# Altium project Virtex.PrjPcb (part 2 of 3)

## Sheet BoardB-FPGA.SchDoc
size A; SheetNumber: 3; SheetTotal: 9
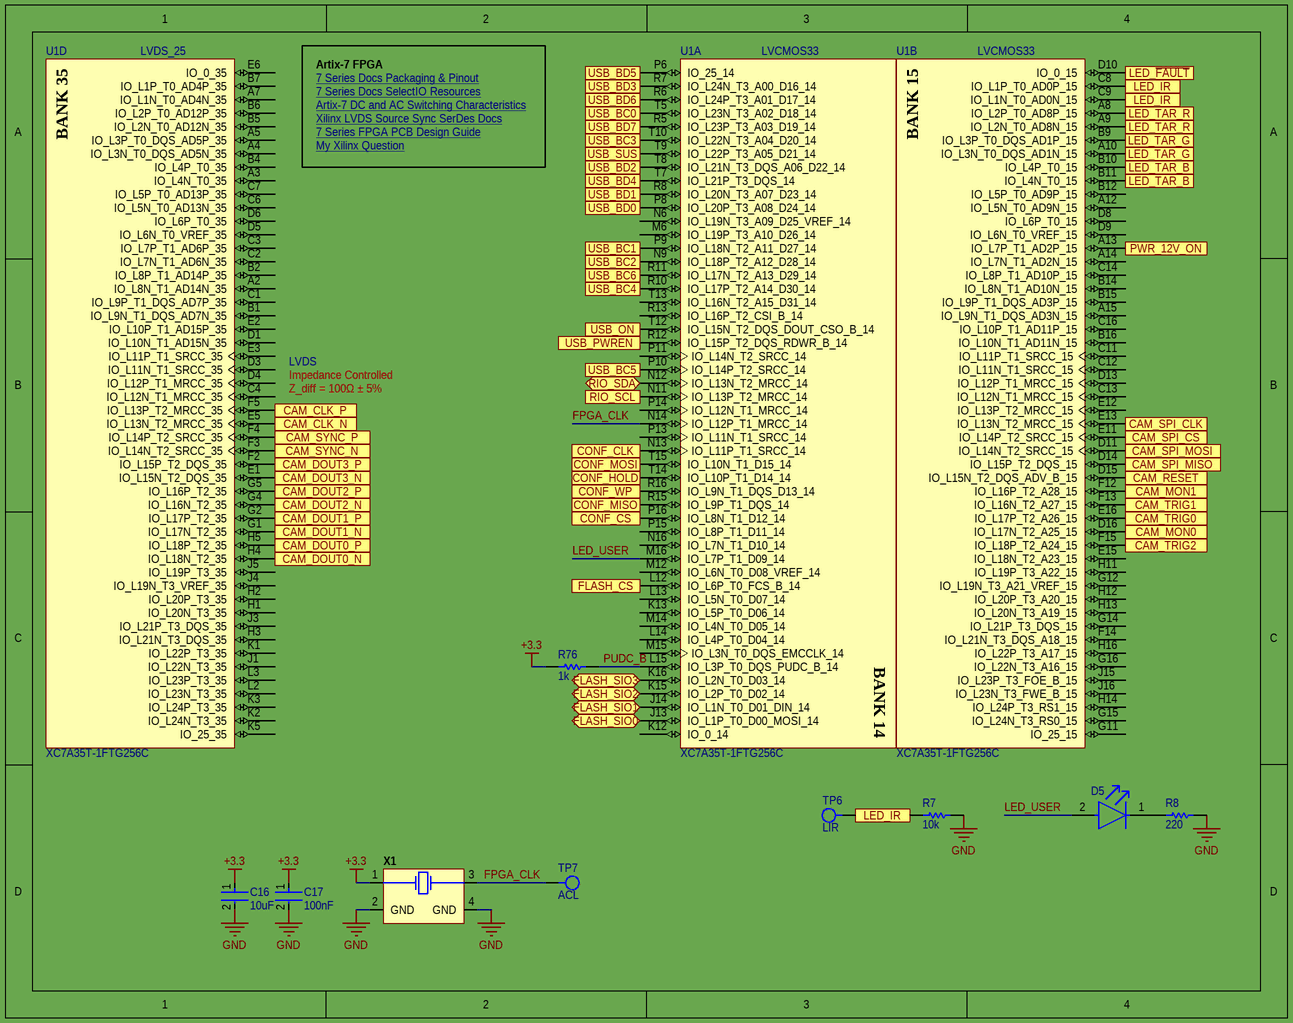
[diagram p2: BoardB-FPGA.SchDoc]

### Parts
C16  10uF  [FP-GRM188-0_1-e0_2_0_55-IPC_A]
C17  100nF  [FP-CGA3E-0_3-0_1-IPC_A]
D5  SML-D12U1WT86  [FP-SML-D12-MFG]  (value not drawn)
R7  10k  [RESC1609X55X30LL15T15]
R8  220  [RESC1005X40X25LL05T05]
R76  1k  [RESC0603X26X15ML03T05]
TP6  LIR  [TestPoint1mm]
TP7  ACL  [TestPoint1mm]
U1  XC7A35T-1FTG256C  [FTG256]  (parts A,B,D of 8)
X1  ASDMB-100.000MHZ-XY-T  [ASTMHTA-100.000MHZ-AJ-E-T]  (value not drawn)

### Ports
CAM_CLK_N (in), CAM_CLK_P (in), CAM_DOUT0_N (in), CAM_DOUT0_P (in), CAM_DOUT1_N (in), CAM_DOUT1_P (in), CAM_DOUT2_N (in), CAM_DOUT2_P (in), CAM_DOUT3_N (in), CAM_DOUT3_P (in), CAM_MON0 (in), CAM_MON1 (in), CAM_RESET (out), CAM_SPI_CLK (out), CAM_SPI_CS (out), CAM_SPI_MISO (in), CAM_SPI_MOSI (out), CAM_SYNC_N (in), CAM_SYNC_P (in), CAM_TRIG0 (out), CAM_TRIG1 (out), CAM_TRIG2 (out), CONF_CLK (out), CONF_CS (out), CONF_HOLD (out), CONF_MISO (in), CONF_MOSI (out), CONF_WP (out), FLASH_CS (out), FLASH_SIO0 (bidir), FLASH_SIO1 (bidir), FLASH_SIO2 (bidir), FLASH_SIO3 (bidir), LED_IR (out), LED_TAR_B (out), LED_TAR_G (out), LED_TAR_R (out), LED_~{FAULT} (in), PWR_12V_ON (in), RIO_SCL (in), RIO_SDA (bidir), USB_BC0, USB_BC1, USB_BC2, USB_BC3, USB_BC4, USB_BC5, USB_BC6, USB_BD0, USB_BD1, USB_BD2, USB_BD3, USB_BD4, USB_BD5, USB_BD6, USB_BD7, USB_ON (out), USB_PWREN (in), USB_SUS (in)

### Nets
+3.3: C16.1 C17.1 R76.2 X1.1
GND: C16.2 C17.2 R7.2 R8.2 X1.2(GND) X1.4(GND)
CAM_CLK_N: U1.E5(IO_L13N_T2_MRCC_35) ; port CAM_CLK_N
CAM_CLK_P: U1.F5(IO_L13P_T2_MRCC_35) ; port CAM_CLK_P
CAM_DOUT0_N: U1.H4(IO_L18N_T2_35) ; port CAM_DOUT0_N
CAM_DOUT0_P: U1.H5(IO_L18P_T2_35) ; port CAM_DOUT0_P
CAM_DOUT1_N: U1.G1(IO_L17N_T2_35) ; port CAM_DOUT1_N
CAM_DOUT1_P: U1.G2(IO_L17P_T2_35) ; port CAM_DOUT1_P
CAM_DOUT2_N: U1.G4(IO_L16N_T2_35) ; port CAM_DOUT2_N
CAM_DOUT2_P: U1.G5(IO_L16P_T2_35) ; port CAM_DOUT2_P
CAM_DOUT3_N: U1.E1(IO_L15N_T2_DQS_35) ; port CAM_DOUT3_N
CAM_DOUT3_P: U1.F2(IO_L15P_T2_DQS_35) ; port CAM_DOUT3_P
CAM_MON0: U1.D16(IO_L17N_T2_A25_15) ; port CAM_MON0
CAM_MON1: U1.F12(IO_L16P_T2_A28_15) ; port CAM_MON1
CAM_RESET: U1.D15(IO_L15N_T2_DQS_ADV_B_15) ; port CAM_RESET
CAM_SPI_CLK: U1.E13(IO_L13N_T2_MRCC_15) ; port CAM_SPI_CLK
CAM_SPI_CS: U1.E11(IO_L14P_T2_SRCC_15) ; port CAM_SPI_CS
CAM_SPI_MISO: U1.D14(IO_L15P_T2_DQS_15) ; port CAM_SPI_MISO
CAM_SPI_MOSI: U1.D11(IO_L14N_T2_SRCC_15) ; port CAM_SPI_MOSI
CAM_SYNC_N: U1.F3(IO_L14N_T2_SRCC_35) ; port CAM_SYNC_N
CAM_SYNC_P: U1.F4(IO_L14P_T2_SRCC_35) ; port CAM_SYNC_P
CAM_TRIG0: U1.E16(IO_L17P_T2_A26_15) ; port CAM_TRIG0
CAM_TRIG1: U1.F13(IO_L16N_T2_A27_15) ; port CAM_TRIG1
CAM_TRIG2: U1.F15(IO_L18P_T2_A24_15) ; port CAM_TRIG2
CONF_CLK: U1.N13(IO_L11P_T1_SRCC_14) ; port CONF_CLK
CONF_CS: U1.P16(IO_L8N_T1_D12_14) ; port CONF_CS
CONF_HOLD: U1.T14(IO_L10P_T1_D14_14) ; port CONF_HOLD
CONF_MISO: U1.R15(IO_L9P_T1_DQS_14) ; port CONF_MISO
CONF_MOSI: U1.T15(IO_L10N_T1_D15_14) ; port CONF_MOSI
CONF_WP: U1.R16(IO_L9N_T1_DQS_D13_14) ; port CONF_WP
FLASH_CS: U1.L12(IO_L6P_T0_FCS_B_14) ; port FLASH_CS
FLASH_SIO0: U1.J13(IO_L1P_T0_D00_MOSI_14) ; port FLASH_SIO0
FLASH_SIO1: U1.J14(IO_L1N_T0_D01_DIN_14) ; port FLASH_SIO1
FLASH_SIO2: U1.K15(IO_L2P_T0_D02_14) ; port FLASH_SIO2
FLASH_SIO3: U1.K16(IO_L2N_T0_D03_14) ; port FLASH_SIO3
FPGA_CLK: TP7.1 U1.N14(IO_L12P_T1_MRCC_14) X1.3
LED_USER: D5.2(A) U1.M16(IO_L7P_T1_D09_14)
PUDC_B: R76.1 U1.L15(IO_L3P_T0_DQS_PUDC_B_14)
USB_BC0: U1.T5(IO_L23N_T3_A02_D18_14) ; port USB_BC0
USB_BC1: U1.P9(IO_L18N_T2_A11_D27_14) ; port USB_BC1
USB_BC2: U1.N9(IO_L18P_T2_A12_D28_14) ; port USB_BC2
USB_BC3: U1.T10(IO_L22N_T3_A04_D20_14) ; port USB_BC3
USB_BC4: U1.R10(IO_L17P_T2_A14_D30_14) ; port USB_BC4
USB_BC5: U1.P10(IO_L14P_T2_SRCC_14) ; port USB_BC5
USB_BC6: U1.R11(IO_L17N_T2_A13_D29_14) ; port USB_BC6
USB_BD0: U1.P8(IO_L20P_T3_A08_D24_14) ; port USB_BD0
USB_BD1: U1.R8(IO_L20N_T3_A07_D23_14) ; port USB_BD1
USB_BD2: U1.T8(IO_L21N_T3_DQS_A06_D22_14) ; port USB_BD2
USB_BD3: U1.R7(IO_L24N_T3_A00_D16_14) ; port USB_BD3
USB_BD4: U1.T7(IO_L21P_T3_DQS_14) ; port USB_BD4
USB_BD5: U1.P6(IO_25_14) ; port USB_BD5
USB_BD6: U1.R6(IO_L24P_T3_A01_D17_14) ; port USB_BD6
USB_BD7: U1.R5(IO_L23P_T3_A03_D19_14) ; port USB_BD7
USB_PWREN: U1.R12(IO_L15P_T2_DQS_RDWR_B_14) ; port USB_PWREN
USB_PWRSAV: U1.T12(IO_L15N_T2_DQS_DOUT_CSO_B_14) ; port USB_ON
USB_SUS: U1.T9(IO_L22P_T3_A05_D21_14) ; port USB_SUS
NetD5_1: D5.1(C) R8.1
NetR1_1: U1.N12(IO_L13N_T2_MRCC_14) ; port RIO_SDA
NetR3_1: U1.N11(IO_L13P_T2_MRCC_14) ; port RIO_SCL
NetR5_1: U1.A13(IO_L7P_T1_AD2P_15) ; port PWR_12V_ON
NetR7_1: R7.1 TP6.1 U1.C8(IO_L1P_T0_AD0P_15) U1.C9(IO_L1N_T0_AD0N_15) ; port LED_IR
NetR51_2: U1.D10(IO_0_15) ; port LED_~{FAULT}
NetR63_2: U1.A8(IO_L2P_T0_AD8P_15) U1.A9(IO_L2N_T0_AD8N_15) ; port LED_TAR_R
NetR64_2: U1.A10(IO_L3N_T0_DQS_AD1N_15) U1.B9(IO_L3P_T0_DQS_AD1P_15) ; port LED_TAR_G
NetR65_2: U1.B10(IO_L4P_T0_15) U1.B11(IO_L4N_T0_15) ; port LED_TAR_B

Not connected (* = marked no-connect by the designer): U1 A2(IO_L8N_T1_AD14N_35) A3(IO_L4N_T0_35) A4(IO_L3N_T0_DQS_AD5N_35) A5(IO_L3P_T0_DQS_AD5P_35) A7(IO_L1N_T0_AD4N_35) A12(IO_L5N_T0_AD9N_15) A14(IO_L7N_T1_AD2N_15) A15(IO_L9N_T1_DQS_AD3N_15) B1(IO_L9N_T1_DQS_AD7N_35) B2(IO_L8P_T1_AD14P_35) B4(IO_L4P_T0_35) B5(IO_L2N_T0_AD12N_35) B6(IO_L2P_T0_AD12P_35) B7(IO_L1P_T0_AD4P_35) B12(IO_L5P_T0_AD9P_15) B14(IO_L8N_T1_AD10N_15) B15(IO_L9P_T1_DQS_AD3P_15) B16(IO_L10N_T1_AD11N_15) C1(IO_L9P_T1_DQS_AD7P_35) C2(IO_L7N_T1_AD6N_35) C3(IO_L7P_T1_AD6P_35) C4(IO_L12N_T1_MRCC_35) C6(IO_L5N_T0_AD13N_35) C7(IO_L5P_T0_AD13P_35) C11(IO_L11P_T1_SRCC_15) C12(IO_L11N_T1_SRCC_15) C13(IO_L12N_T1_MRCC_15) C14(IO_L8P_T1_AD10P_15) C16(IO_L10P_T1_AD11P_15) D1(IO_L10N_T1_AD15N_35) D3(IO_L11N_T1_SRCC_35) D4(IO_L12P_T1_MRCC_35) D5(IO_L6N_T0_VREF_35) D6(IO_L6P_T0_35) D8(IO_L6P_T0_15) D9(IO_L6N_T0_VREF_15) D13(IO_L12P_T1_MRCC_15) E2(IO_L10P_T1_AD15P_35) E3(IO_L11P_T1_SRCC_35) E6(IO_0_35) E12(IO_L13P_T2_MRCC_15) E15(IO_L18N_T2_A23_15) F14(IO_L21N_T3_DQS_A18_15) G11(IO_25_15) G12(IO_L19N_T3_A21_VREF_15) G14(IO_L21P_T3_DQS_15) G15(IO_L24N_T3_RS0_15) G16(IO_L22N_T3_A16_15) H1(IO_L20N_T3_35) H2(IO_L20P_T3_35) H3(IO_L21N_T3_DQS_35) H11(IO_L19P_T3_A22_15) H12(IO_L20P_T3_A20_15) H13(IO_L20N_T3_A19_15) H14(IO_L24P_T3_RS1_15) H16(IO_L22P_T3_A17_15) J1(IO_L22N_T3_35) J3(IO_L21P_T3_DQS_35) J4(IO_L19N_T3_VREF_35) J5(IO_L19P_T3_35) J15(IO_L23P_T3_FOE_B_15) J16(IO_L23N_T3_FWE_B_15) K1(IO_L22P_T3_35) K2(IO_L24N_T3_35) K3(IO_L24P_T3_35) K5(IO_25_35) K12(IO_0_14) K13(IO_L5P_T0_D06_14) L2(IO_L23N_T3_35) L3(IO_L23P_T3_35) L13(IO_L5N_T0_D07_14) L14(IO_L4P_T0_D04_14) M6(IO_L19P_T3_A10_D26_14) M12(IO_L6N_T0_D08_VREF_14) M14(IO_L4N_T0_D05_14) M15(IO_L3N_T0_DQS_EMCCLK_14) N6(IO_L19N_T3_A09_D25_VREF_14) N16(IO_L7N_T1_D10_14) P11(IO_L14N_T2_SRCC_14) P13(IO_L11N_T1_SRCC_14) P14(IO_L12N_T1_MRCC_14) P15(IO_L8P_T1_D11_14) R13(IO_L16P_T2_CSI_B_14) T13(IO_L16N_T2_A15_D31_14)

### Notes on the sheet
- (near U1) LVDS_25
- Artix-7 FPGA
- 7 Series Docs Packaging & Pinout <https://www.xilinx.com/support/documentation/user_guides/ug475_7Series_Pkg_Pinout.pdf>
- 7 Series Docs SelectIO Resources <https://www.xilinx.com/support/documentation/user_guides/ug471_7Series_SelectIO.pdf>
- LVCMOS33
- My Xilinx Question <https://forums.xilinx.com/t5/Video-and-Audio/Artix-7-LVDS-25-Speeds/td-p/1290996>
- Artix-7 DC and AC Switching Characteristics <https://www.xilinx.com/support/documentation/data_sheets/ds181_Artix_7_Data_Sheet.pdf>
- Xilinx LVDS Source Sync SerDes Docs <https://www.xilinx.com/content/dam/xilinx/support/documentation/application_notes/xapp585-lvds-source-synch-serdes-clock-multiplication.pdf>
- 7 Series FPGA PCB Design Guide <https://www.xilinx.com/support/documentation/user_guides/ug483_7Series_PCB.pdf>
- LVDS
- Impedance Controlled
- Z_diff = 100Ω ± 5%
- (in symbol CMP-0383-00028-1, part A) BANK 14
- (in symbol CMP-0383-00028-1, part B) BANK 15
- (in symbol CMP-0383-00028-1, part D) BANK 35
- (in symbol CMP-0383-00028-1, part C) BANK 34

### Library data of the parts
C16 = CMP-2006-02792-2: Chip Multilayer Ceramic Capacitors for General Purpose, 0603, 10uF, X5R, 15%, 20%, 6.3V; Packaging: Tape and Reel; Voltage Rating (DC): 6.3V; Width: 0.031inch; Termination: SMD/SMT; Dielectric: X5R; Package Quantity: 4000; Voltage Rating: 6.3V; Capacitance: 10uF; Case/Package: 0603; Min Operating Temperature: -55°C; Voltage: 6.3V; Length: 1.6mm; Thickness: 0.035inch; Lead Free: Lead Free; Depth: 0.8mm; Case Code (Imperial): 0603; Max Operating Temperature: 85°C; Material: Ceramic; Height: 0.8mm; Tolerance: 20%; Mount: Surface Mount; REACH SVHC: No SVHC; Radiation Hardening: No; Case Code (Metric): 1608
C17 = CMP-2000-07546-2: Cap Ceramic 100nF 50V X7R 10% Pad SMD 0603 +125°C Automotive T/R; Weight: 7.1E-05oz; Composition: Ceramic; Max Operating Temperature: 125°C; Termination: SMD/SMT; Dielectric: X7R; Length: 1.6mm; Package Quantity: 1; REACH SVHC: No SVHC; Lead Free: Lead Free; Case Code (Metric): 1608; Min Operating Temperature: -55°C; Packaging: Tape and Reel; Tolerance: 10%; Voltage Rating: 50V; Case Code (Imperial): 0603; Capacitance: 100nF; Case/Package: 0603; Voltage Rating (DC): 50V; Depth: 0.8mm; Radiation Hardening: No; Ratings: AEC-Q200; Mount: Surface Mount; Voltage: 50V; Thickness: 0.035inch; Width: 0.8mm; Height: 0.8mm
D5 = CMP-08952-000009-1: LED RED DIFFUSED 1608 SMD; Manufacturer: Rohm; Led Orientation: Top View; Power Dissipation: 54mW; Forward Current: 20mA; Wavelength: 620nm; Reverse Voltage: 5V; Luminous Intensity: 63mcd; Forward Voltage: 2.2V; Mouser Description: SML-D12 Series Red 0603 Diffused 63 mcd 2.2 V Surface Mount LED; Temperature: -40°C to +85°C; Device Class L2: LEDs; Lead Free: Yes; Automotive: No; Octopart: https://octopart.com/sml-d12u1wt86-rohm-70850259; RoHS: TRUE; Colour: Red; Digikey Description: LED RED DIFFUSED 1608 SMD; Package: SML-D12; Device Class L1: Optoelectronics; Category: Diode; Temperature Range High: +85°C; Height: 0.65mm; ComponentLink2Description: Datasheet; Temperature Range Low: -40°C; ComponentLink2URL: https://www.rohm.com/datasheet/SML-D12U1W/sml-d12x1-e; Manufacturer Part Number: SML-D12U1WT86; Device Class L3: unset
R7 = CMP-1012-00623-3: Chip Resistor, 10 KOhm, +/- 1%, 0.1 W, -55 to 155 degC, 0603 (1608 Metric), RoHS, Tape and Reel; Manufacturer: Panasonic; Voltage Rating: 75V; Case\/Package: 0603; Power Rating: 100mW; Resistance: 10KOhm; Temperature Coefficient: 100ppm\/degreesC; Number of Pins: 2; Package Reference: 603; Depth: 0.8mm; Mount: SurfaceMount; Package Description: 2-Pin Surface Mount Device, Body 1.6 x 0.85 mm; Datasheet Version: 02/2017; Length: 1.6mm; Lead Free: LeadFree; Height: 0.45mm; Number of Terminations: 2; Max Power Dissipation: 100mW; Min Operating Temperature: -55degC; Datasheet URL: https://industrial.panasonic.com/cdbs/www-data/pdf/RDA0000/AOA0000C304.pdf; Termination: SMD/SMT; Case Code (Metric): 1608; Case Code (Imperial): 0603; Tolerance: 1%; Max Operating Temperature: 155degC; RoHSCompliant: true; Voltage Rating (DC): 75V; Radiation Hardening: No; Packaging: TapeandReel; Composition: ThickFilm; Mounting Technology: SurfaceMount; Manufacturer URL: http://www.panasonic.com/; Width: 0.031inch; REACH SVHC: NoSVHC; Contact Plating: Tin; Military Standard: Not; Package Quantity: 1
R8 = CMP-2002-00487-3: Chip Resistor, 220 Ohm, +/- 5%, 100 mW, -55 to 155 degC, 0402 (1005 Metric), RoHS, Tape and Reel; Manufacturer: Basic Passives; PartNumber: ERJ-2GEJ221X; Voltage Rating: 50 V; Case\/Package: 0402; Power Rating: 100 mW; Resistance: 220 Ohm; Mounting Technology: Surface Mount; Width: 0.5 mm; Package Quantity: 10000; REACH SVHC: Unknown; Height: 0.35 mm; PackageReference: 0402; PackageDescription: 2-Pin Surface Mount Device, Body 1 x 0.5 mm; Length: 1 mm; Max Operating Temperature: 155 degC; Tolerance: 5%; ComponentLink1Description: Manufacturer URL; Pins: 2; ComponentLink1URL: http://www.panasonic.com/; Min Operating Temperature: -55 degC; Case Code (Imperial): 0402; Mount: Surface Mount; Case Code (Metric): 1005; ComponentLink2URL: http://industrial.panasonic.com/cdbs/www-data/pdf/RDA0000/AOA0000C84.pdf; Packaging: Tape and Reel; ComponentLink2Description: Datasheet; DatasheetVersion: 04/2015; Radiation Hardening: No; RoHSCompliant: true
R76 = CMP-1010-00416-2: Manufacturer: Panasonic; Part Number: ERJ1GNF1001C
TP6 TP7 = TestPoint1mm: Test Point 1mm Diameter
U1 = CMP-0383-00028-1: Artix-7 FPGA, 170 User I/Os, 0 GTP, 256-Ball BGA, Speed Grade 1, Commercial Grade, Pb-Free; Manufacturer: Xilinx; Speed Grades: 1; Total Block RAM: 1800 Kb; CMTs: 5; GTP: 0; Available User I/O: 170; Logic Cells: 33280; ComponentLink2Description: Datasheet; ComponentLink2URL: http://www.xilinx.com/support/documentation/data_sheets/ds180_7Series_Overview.pdf; ComponentLink1Description: Manufacturer URL; Operating Temperature Range: Commercial; PackageVersion: Rev. 1.11; ComponentLink4URL: http://www.xilinx.com/support/documentation/user_guides/ug475_7Series_Pkg_Pinout.pdf; ComponentLink4Description: Package Specification; PackageDescription: 256-Ball Wire-Bond Fine-Pitch Thin BGA, Body 17 x 17 mm, Pitch 1 mm; Mounting Technology: Surface Mount; ComponentLink1URL: http://www.xilinx.com/; Maximum Distributed RAM: 400 Kb; PackageReference: FTG-256; DatasheetVersion: Rev. 1.15; ComponentLink3Description: Pinout; PartNumber: XC7A35T-1FTG256C; ComponentLink3URL: http://www.xilinx.com/support/documentation/user_guides/ug475_7Series_Pkg_Pinout.pdf
X1 = ASTMHTA-100.000MHZ-AJ-E-T: MEMS OSC XO 100.0000MHZ LVCMOS; Manufacturer: Abracon; Frequency: 100MHz; Load Capacitance: 15pF; Operating Supply Voltage: 3.6V; Frequency Stability: 10ppm; Max Supply Current: 16mA; RoHS: Yes; Stock 1: 2824; Pricing 1: 1=3.08000, 10=2.93800, 50=2.79080, 100=2.49700, 500=2.35008 (USD); Mount: Surface Mount; Case/Package: SMD/SMT; Number of Pins: 4; Min Operating Temperature: -40°C; Max Operating Temperature: 105°C; Packaging: Tape and Reel; Termination: SMD/SMT; Series: Pure Silicon™ ASDMB; Length: 0.098inch; Width: 0.079inch; Height: 0.035inch; Radiation Hardening: No; RoHS Compliant: Yes; Lead Free: Lead Free; ComponentLink1URL: https://datasheet.ciiva.com/1389/1750124-1389392.pdf?src-supplier=Newark; ComponentLink1Description: https://datasheet.ciiva.com/1389/1750124-1389392.pdf?src-supplier=Newark; ComponentLink2URL: https://datasheet.ciiva.com/866/asdmb-866812.pdf?src-supplier=Digi-Key; ComponentLink2Description: https://datasheet.ciiva.com/866/asdmb-866812.pdf?src-supplier=Digi-Key; ComponentLink3URL: https://datasheet.ciiva.com/866/asdmb-866813.pdf?src-supplier=Digi-Key; ComponentLink3Description: https://datasheet.ciiva.com/866/asdmb-866813.pdf?src-supplier=Digi-Key; ComponentLink4URL: https://datasheet.ciiva.com/866/asdmb-866814.pdf?src-supplier=Digi-Key; ComponentLink4Description: https://datasheet.ciiva.com/866/asdmb-866814.pdf?src-supplier=Digi-Key; ComponentLink5URL: https://datasheet.ciiva.com/3177/asdmb-3177639.pdf?src-supplier=Avnet; ComponentLink5Description: https://datasheet.ciiva.com/3177/asdmb-3177639.pdf?src-supplier=Avnet; Manufacturer Part Number: ASTMHTA-100.000MHZ-AJ-E-T; Category: Oscillators; Supplier 1: Digi-Key; Supplier Part Number 1: 535-15297-1-ND

## Sheet BoardB-FPGA2.SchDoc
size A; SheetNumber: 4; SheetTotal: 9
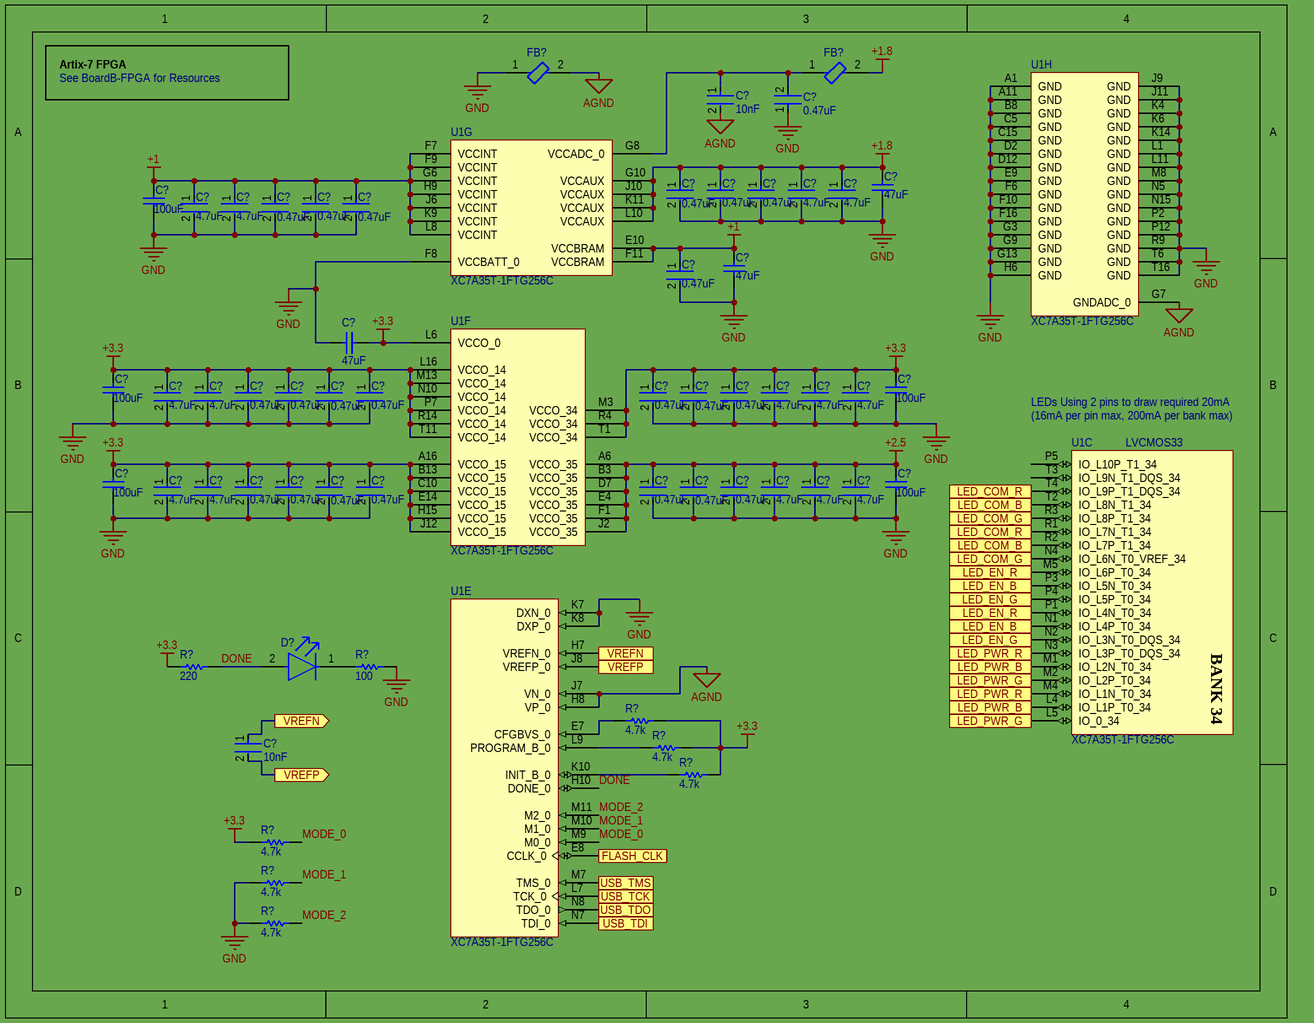
[diagram p3: BoardB-FPGA2.SchDoc]

### Parts
(Parts that share a designator on the sheet are numbered #1, #2 ... from top to bottom, then left to right.)
C?#1  10nF  [FP-GRM033-0_03-IPC_A]
C?#2  0.47uF  [FP-GRM033-0_03-IPC_C]
C?#3  0.47uF  [FP-GRM033-0_03-IPC_C]
C?#4  0.47uF  [FP-GRM033-0_03-IPC_C]
C?#5  0.47uF  [FP-GRM033-0_03-IPC_C]
C?#6  4.7uF  [FP-GRM155-0_1-IPC_B]
C?#7  4.7uF  [FP-GRM155-0_1-IPC_B]
C?#8  4.7uF  [FP-GRM155-0_1-IPC_B]
C?#9  4.7uF  [FP-GRM155-0_1-IPC_B]
C?#10  0.47uF  [FP-GRM033-0_03-IPC_C]
C?#11  0.47uF  [FP-GRM033-0_03-IPC_C]
C?#12  0.47uF  [FP-GRM033-0_03-IPC_C]
C?#13  47uF  [MURA-1210_H_2.7_L]
C?#14  100uF  [CAPC3216X190X55ML30T25]
C?#15  0.47uF  [FP-GRM033-0_03-IPC_C]
C?#16  47uF  [MURA-1210_H_2.7_L]
C?#17  47uF  [MURA-1210_H_2.7_L]
C?#18  4.7uF  [FP-GRM155-0_1-IPC_B]
C?#19  4.7uF  [FP-GRM155-0_1-IPC_B]
C?#20  0.47uF  [FP-GRM033-0_03-IPC_C]
C?#21  0.47uF  [FP-GRM033-0_03-IPC_C]
C?#22  0.47uF  [FP-GRM033-0_03-IPC_C]
C?#23  0.47uF  [FP-GRM033-0_03-IPC_C]
C?#24  0.47uF  [FP-GRM033-0_03-IPC_C]
C?#25  0.47uF  [FP-GRM033-0_03-IPC_C]
C?#26  0.47uF  [FP-GRM033-0_03-IPC_C]
C?#27  4.7uF  [FP-GRM155-0_1-IPC_B]
C?#28  4.7uF  [FP-GRM155-0_1-IPC_B]
C?#29  4.7uF  [FP-GRM155-0_1-IPC_B]
C?#30  100uF  [CAPC3216X190X55ML30T25]
C?#31  100uF  [CAPC3216X190X55ML30T25]
C?#32  4.7uF  [FP-GRM155-0_1-IPC_B]
C?#33  4.7uF  [FP-GRM155-0_1-IPC_B]
C?#34  0.47uF  [FP-GRM033-0_03-IPC_C]
C?#35  0.47uF  [FP-GRM033-0_03-IPC_C]
C?#36  0.47uF  [FP-GRM033-0_03-IPC_C]
C?#37  0.47uF  [FP-GRM033-0_03-IPC_C]
C?#38  0.47uF  [FP-GRM033-0_03-IPC_C]
C?#39  0.47uF  [FP-GRM033-0_03-IPC_C]
C?#40  0.47uF  [FP-GRM033-0_03-IPC_C]
C?#41  4.7uF  [FP-GRM155-0_1-IPC_B]
C?#42  4.7uF  [FP-GRM155-0_1-IPC_B]
C?#43  4.7uF  [FP-GRM155-0_1-IPC_B]
C?#44  100uF  [CAPC3216X190X55ML30T25]
C?#45  100uF  [CAPC3216X190X55ML30T25]
C?#46  10nF  [FP-CC0201-BA-MFG]
D?  SML-D12U1WT86  [FP-SML-D12-MFG]  (value not drawn)
FB?#1  BLM18AG601SN1D  [FP-BLM18-0_15-t0_8-MFG]  (value not drawn)
FB?#2  BLM18AG601SN1D  [FP-BLM18-0_15-t0_8-MFG]  (value not drawn)
R?#1  220  [RESC1005X40X25LL05T05]
R?#2  100  [RESC1005X40X25LL05T05]
R?#3  4.7k  [RESC1005X40X25LL05T05]
R?#4  4.7k  [RESC1005X40X25LL05T05]
R?#5  4.7k  [RESC1005X40X25LL05T05]
R?#6  4.7k  [RESC1005X40X25LL05T05]
R?#7  4.7k  [RESC1005X40X25LL05T05]
R?#8  4.7k  [RESC1005X40X25LL05T05]
U1  XC7A35T-1FTG256C  [FTG256]  (parts C,E,F,G,H of 8)

### Ports
FLASH_CLK (in), LED_COM_B (out), LED_COM_G (out), LED_COM_R (out), LED_EN_B (out), LED_EN_G (out), LED_EN_R (out), LED_PWR_B (out), LED_PWR_G (out), LED_PWR_R (out), USB_TCK, USB_TDI, USB_TDO, USB_TMS, VREFN (out), VREFP (out)

### Nets
+1: C?#8.1 C?#9.1 C?#10.1 C?#11.1 C?#12.1 C?#14.2 C?#15.1 C?#16.2 U1.E10(VCCBRAM) U1.F7(VCCINT) U1.F9(VCCINT) U1.F11(VCCBRAM) U1.G6(VCCINT) U1.H9(VCCINT) U1.J6(VCCINT) U1.K9(VCCINT) U1.L8(VCCINT)
+1.8: C?#3.1 C?#4.1 C?#5.1 C?#6.1 C?#7.1 C?#13.2 FB?#2.2 U1.G10(VCCAUX) U1.J10(VCCAUX) U1.K11(VCCAUX) U1.L10(VCCAUX)
+2.5: C?#38.1 C?#39.1 C?#40.1 C?#41.1 C?#42.1 C?#43.1 C?#45.2 U1.A6(VCCO_35) U1.B3(VCCO_35) U1.D7(VCCO_35) U1.E4(VCCO_35) U1.F1(VCCO_35) U1.J2(VCCO_35)
+3.3: C?#17.1 C?#18.1 C?#19.1 C?#20.1 C?#21.1 C?#22.1 C?#23.1 C?#24.1 C?#25.1 C?#26.1 C?#27.1 C?#28.1 C?#29.1 C?#30.2 C?#31.2 C?#32.1 C?#33.1 C?#34.1 C?#35.1 C?#36.1 C?#37.1 C?#44.2 R?#1.1 R?#3.1 R?#4.1 R?#5.2 R?#6.2 U1.A16(VCCO_15) U1.B13(VCCO_15) U1.C10(VCCO_15) U1.E14(VCCO_15) U1.H15(VCCO_15) U1.J12(VCCO_15) U1.L6(VCCO_0) U1.L16(VCCO_14) U1.M3(VCCO_34) U1.M13(VCCO_14) U1.N10(VCCO_14) U1.P7(VCCO_14) U1.R4(VCCO_34) U1.R14(VCCO_14) U1.T1(VCCO_34) U1.T11(VCCO_14)
AGND: C?#1.2 FB?#1.2 U1.G7(GNDADC_0) U1.H8(VP_0) U1.J7(VN_0)
GND: C?#2.1 C?#3.2 C?#4.2 C?#5.2 C?#6.2 C?#7.2 C?#8.2 C?#9.2 C?#10.2 C?#11.2 C?#12.2 C?#13.1 C?#14.1 C?#15.2 C?#16.1 C?#17.2 C?#18.2 C?#19.2 C?#20.2 C?#21.2 C?#22.2 C?#23.2 C?#24.2 C?#25.2 C?#26.2 C?#27.2 C?#28.2 C?#29.2 C?#30.1 C?#31.1 C?#32.2 C?#33.2 C?#34.2 C?#35.2 C?#36.2 C?#37.2 C?#38.2 C?#39.2 C?#40.2 C?#41.2 C?#42.2 C?#43.2 C?#44.1 C?#45.1 FB?#1.1 R?#2.2 R?#7.2 R?#8.2 U1.A1(GND) U1.A11(GND) U1.B8(GND) U1.C5(GND) U1.C15(GND) U1.D2(GND) U1.D12(GND) U1.E9(GND) U1.F6(GND) U1.F8(VCCBATT_0) U1.F10(GND) U1.F16(GND) U1.G3(GND) U1.G9(GND) U1.G13(GND) U1.H6(GND) U1.J9(GND) U1.J11(GND) U1.K4(GND) U1.K6(GND) U1.K7(DXN_0) U1.K8(DXP_0) U1.K14(GND) U1.L1(GND) U1.L11(GND) U1.M8(GND) U1.N5(GND) U1.N15(GND) U1.P2(GND) U1.P12(GND) U1.R9(GND) U1.T6(GND) U1.T16(GND)
DONE: D?.2(A) R?#1.2 U1.H10(DONE_0)
FLASH_CLK: U1.E8(CCLK_0) ; port FLASH_CLK
MODE_0: R?#6.1 U1.M9(M0_0)
MODE_1: R?#7.1 U1.M10(M1_0)
MODE_2: R?#8.1 U1.M11(M2_0)
USB_TCK: U1.L7(TCK_0) ; port USB_TCK
USB_TDI: U1.N7(TDI_0) ; port USB_TDI
USB_TDO: U1.N8(TDO_0) ; port USB_TDO
USB_TMS: U1.M7(TMS_0) ; port USB_TMS
VREFN: C?#46.1 U1.H7(VREFN_0) ; port VREFN
VREFP: C?#46.2 U1.J8(VREFP_0) ; port VREFP
NetC?#1_1: C?#1.1 C?#2.2 FB?#2.1 U1.G8(VCCADC_0)
NetD?_1: D?.1(C) R?#2.1
NetR60_2: U1.M5(IO_L6P_T0_34) U1.P1(IO_L4N_T0_34) ; port LED_EN_R
NetR61_2: U1.N2(IO_L3N_T0_DQS_34) U1.P4(IO_L5P_T0_34) ; port LED_EN_G
NetR62_2: U1.N1(IO_L4P_T0_34) U1.P3(IO_L5N_T0_34) ; port LED_EN_B
NetR66_2: U1.R1(IO_L7N_T1_34) U1.T4(IO_L9P_T1_DQS_34) ; port LED_COM_R
NetR67_2: U1.N4(IO_L6N_T0_VREF_34) U1.R3(IO_L8P_T1_34) ; port LED_COM_G
NetR68_2: U1.R2(IO_L7P_T1_34) U1.T2(IO_L8N_T1_34) ; port LED_COM_B
NetR69_2: U1.M4(IO_L1N_T0_34) U1.N3(IO_L3P_T0_DQS_34) ; port LED_PWR_R
NetR70_2: U1.L5(IO_0_34) U1.M2(IO_L2P_T0_34) ; port LED_PWR_G
NetR71_2: U1.L4(IO_L1P_T0_34) U1.M1(IO_L2N_T0_34) ; port LED_PWR_B
NetR?#3_2: R?#3.2 U1.E7(CFGBVS_0)
NetR?#4_2: R?#4.2 U1.L9(PROGRAM_B_0)
NetR?#5_1: R?#5.1 U1.K10(INIT_B_0)

Not connected (* = marked no-connect by the designer): U1 P5(IO_L10P_T1_34) T3(IO_L9N_T1_DQS_34)

### Notes on the sheet
- Artix-7 FPGA
- See BoardB-FPGA for Resources
- LEDs Using 2 pins to draw required 20mA
- (near U1) (16mA per pin max, 200mA per bank max)
- LVCMOS33
- (in symbol CMP-0383-00028-1, part C) BANK 34

### Library data of the parts
C?#1 = CMP-2010-01684-2: Chip Multilayer Ceramic Capacitors for General Purpose, 0201, 10000pF, X7R, 15%, 10%, 10V; Package Quantity: 1; Width: 0.012inch; Voltage: 10V; Mount: Surface Mount; Capacitance: 10nF; Voltage Rating (DC): 10V; Voltage Rating: 10V; Length: 0.6mm; Packaging: Tape and Reel; Material: Ceramic; Dielectric: X7R; REACH SVHC: No SVHC; Termination: SMD/SMT; Case/Package: 0201; Radiation Hardening: No; Height: 0.3mm; Tolerance: 10%; Case Code (Imperial): 0201; Min Operating Temperature: -55°C; Lead Free: Lead Free; Thickness: 0.013inch; Depth: 0.3mm; Case Code (Metric): 0603; Max Operating Temperature: 125°C
C?#2-C?#5 C?#10-C?#12 C?#15 C?#20-C?#26 C?#34-C?#40 = CMP-06035-010465-1: Chip Multilayer Ceramic Capacitors for General Purpose, 0201, 0.47uF, X5R, 15%, 10%, 6.3V; Capacitance: 470nF; Thickness: 0.013inch; Depth: 0.3mm; Height: 0.3mm; Mount: Surface Mount; Max Operating Temperature: 85°C; Tolerance: 10%; Dielectric: X5R; Length: 0.6mm; Package Quantity: 15000; Weight: 1.2E-05oz; Voltage Rating (DC): 6.3V; Lead Free: Lead Free; Termination: SMD/SMT; Voltage Rating: 6.3V; Case Code (Imperial): 0201; Width: 0.012inch; Case/Package: 0201; Case Code (Metric): 0603; Min Operating Temperature: -55°C; Packaging: Tape and Reel
C?#6-C?#9 C?#18 C?#19 C?#27-C?#29 C?#32 C?#33 C?#41-C?#43 = CMP-2008-04549-2: Chip Multilayer Ceramic Capacitors for General Purpose, 0402, 4.7uF, X5R, 15%, 20%, 6.3V; Height: 0.5mm; Weight: 0.000212oz; Length: 1mm; Case Code (Metric): 1005; Packaging: Tape and Reel; Termination: SMD/SMT; Dielectric: X5R; Depth: 0.5mm; Case Code (Imperial): 0402; Min Operating Temperature: -55°C; Case/Package: 0402; Voltage: 6.3V; Width: 0.02inch; Capacitance: 4.7uF; Lead Free: Lead Free; Thickness: 0.022inch; Contact Plating: Tin; REACH SVHC: No SVHC; Package Quantity: 10000; Tolerance: 20%; Voltage Rating (DC): 6.3V; Voltage Rating: 6.3V; Mount: Surface Mount; Max Operating Temperature: 85°C
C?#13 C?#16 C?#17 = CMP-2000-06362-1: Cap Ceramic, 47 uF, +/- 10%, -55 to 85 degC, 2-Pin SMD (1210), RoHS, Tape and Reel; Manufacturer: Murata; Catalog Drawings: GRMSeries_1210_2.5; Voltage Rating DC: 16V; Capacitance: 47µF; Product Training Modules: High-CapMultilayerCeramicCapacitors; Temperature Coefficient: X5R; Online Catalog: GRMSeries; Other Names: 490-6539-6; Lead Style: -; Datasheet URL: http://psearch.en.murata.com/capacitor/product/GRM32ER61C476KE15%23.pdf; Package Description: 2-Pin Surface Mount Device, Body 3.2 x 2.5 mm; Applications: GeneralPurpose; Thickness (Max): 0.106"(2.70mm); Operating Temperature: -55°C~85°C; Mounting Technology: SurfaceMount; Category: Capacitors; Package / Case: 1210(3225Metric); Mounting Type: SurfaceMount,MLCC; Ratings: -; Package Reference: 1210; Height - Seated (Max): -; Series: GRM; Lead Spacing: -; Family: CeramicCapacitors; Datasheet Version: 04/2016; Tolerance: ±10%; Size / Dimension: 0.126"Lx0.098"W(3.20mmx2.50mm); Packaging: Digi-Reel®; Voltage - Rated: 16V; Standard Package: 1; Features: -; Manufacturer URL: http://www.murata.com/
C?#14 C?#30 C?#31 C?#44 C?#45 = CMP-1662-00011-2: Chip Capacitor, 100 uF, +/- 20%, 6.3 V, -55 to 85 degC, 1206 (3216 Metric), RoHS, Tape and Reel; PartNumber: GRM31CR60J107ME39L; Case\/Package: 1206; Voltage Rating (DC): 6.3 V; Type (Capacitors): X5R; REACH SVHC: No SVHC; Height: 1.6 mm; Tolerance: 20%; Packaging: Tape and Reel; Mount: Surface Mount; PackageDescription: 2-Pin Surface Mount Device, Body 3.2 x 1.6 mm; ComponentLink1URL: http://www.murata.com/; Pins: 2; ComponentLink2Description: Datasheet; PackageReference: 1206; Width: 1.6 mm; Package Quantity: 2000; Capacitance: 100 uF; Min Operating Temperature: -55 degC; Case Code (Imperial): 1206; Max Operating Temperature: 85 degC; DatasheetVersion: 09/2016; Mounting Technology: Surface Mount; Voltage Rating: 6.3 V; ComponentLink1Description: Manufacturer URL; Radiation Hardening: No; Case Code (Metric): 3216; Length: 3.2 mm; ComponentLink2URL: http://psearch.en.murata.com/capacitor/product/GRM31CR60J107ME39%23.pdf; RoHSCompliant: true
C?#46 = CMP-03422-000237-1: CAP CER 10000PF 16V X7R 0201; Manufacturer: Yageo; Manufacturer Part Number: CC0201KRX7R7BB103; Material: Ceramic; Tolerance: 0.1; Temperature Coefficient: 15%; Ipc Land Pattern Name: CAPC6030X30; Value: 10 nF; Footprint Url: http://www.yageo.com/exep/pages/download/literatures/UPY-C_GEN_24.pdf; Device Class L2: Capacitors; Mouser Description: Multilayer Ceramic Capacitors MLCC - SMD/SMT 10nF 16V X7R 10%; Octopart: https://octopart.com/cc0201krx7r7bb103-yageo-9292627; Temperature: -55°C to +85°C; Package: CC0201-BA; Capacitance: 10 nF; Device Class L1: Passive Components; Device Class L3: Ceramic Capacitors; Digikey Description: CAP CER 10000PF 16V X7R 0201; ComponentLink2URL: http://www.yageo.com/documents/recent/UPY-GPHC_X5R_4V-to-50V_25.pdf; Temperature Characteristic: X7R; Automotive: No; RoHS: TRUE; Voltage Rating: 16 V; Temperature Range Low: -55°C; Category: Cap; Height: 0.33mm; ComponentLink2Description: Datasheet; Temperature Range High: +85°C; Lead Free: Yes
D? = CMP-08952-000009-1: as D5 on sheet BoardB-FPGA; Mouser Description: SML-D12 Series Red 0603 Diffused 63 mcd 2.2 V Surface Mount LED; Temperature: -40°C to +85°C; Device Class L2: LEDs; Lead Free: Yes; Automotive: No; Octopart: https://octopart.com/sml-d12u1wt86-rohm-70850259; RoHS: TRUE; Colour: Red; Digikey Description: LED RED DIFFUSED 1608 SMD; Package: SML-D12; Device Class L1: Optoelectronics; Category: Diode; Temperature Range High: +85°C; Height: 0.65mm; ComponentLink2Description: Datasheet; Temperature Range Low: -40°C; ComponentLink2URL: https://www.rohm.com/datasheet/SML-D12U1W/sml-d12x1-e; Manufacturer Part Number: SML-D12U1WT86; Device Class L3: unset
FB?#1 FB?#2 = CMP-0686-00436-3: Chip Ferrite Bead, 0603, 600Ω @ 100MHz, 0.38Ω, 25%, 500mA; Number of Lines: 1; Impedance: 600R; DC Resistance (DCR): 380mR; Material: Steel; Shielding: Unshielded; Max DC Current: 500mA; Termination: SMD/SMT; Military Standard: Not; Number of Circuits: 1; Min Operating Temperature: -55°C; Case Code (Imperial): 0603; Width: 0.8mm; Current Rating: 500mA; Lead Free: Lead Free; Packaging: Tape and Reel; Frequency: 100MHz; Max Operating Temperature: 125°C; DC Current: 500mA; REACH SVHC: No SVHC; Case/Package: 0603; Package Quantity: 1; Height: 0.8mm; Number of Pins: 2; Depth: 0.8mm; Test Frequency: 100MHz; Case Code (Metric): 1608; Tolerance: 25%; Core Material: Ferrite; Weight: 7.1E-05oz; Max Current Rating: 500mA; Radiation Hardening: No; Length: 1.6mm; RoHS Compliant: Yes
R?#1 = CMP-2002-00487-3: as R8 on sheet BoardB-FPGA; Mounting Technology: Surface Mount; Width: 0.5 mm; Package Quantity: 10000; REACH SVHC: Unknown; Height: 0.35 mm; PackageReference: 0402; PackageDescription: 2-Pin Surface Mount Device, Body 1 x 0.5 mm; Length: 1 mm; Max Operating Temperature: 155 degC; Tolerance: 5%; ComponentLink1Description: Manufacturer URL; Pins: 2; ComponentLink1URL: http://www.panasonic.com/; Min Operating Temperature: -55 degC; Case Code (Imperial): 0402; Mount: Surface Mount; Case Code (Metric): 1005; ComponentLink2URL: http://industrial.panasonic.com/cdbs/www-data/pdf/RDA0000/AOA0000C84.pdf; Packaging: Tape and Reel; ComponentLink2Description: Datasheet; DatasheetVersion: 04/2015; Radiation Hardening: No; RoHSCompliant: true
R?#2 = CMP-2002-00605-3: Chip Resistor, 100 Ohm, +/- 1%, 100 mW, -55 to 155 degC, 0402 (1005 Metric), RoHS, Tape and Reel; Manufacturer: Basic Passives; PartNumber: ERJ-2RKF1000X; Power Rating: 100 mW; Resistance: 100 Ohm; Voltage Rating: 50 V; Case\/Package: 0402; Width: 0.5 mm; Pins: 2; ComponentLink2Description: Datasheet; PackageReference: 0402; Height: 0.35 mm; Tolerance: 1%; DatasheetVersion: 04/2015; Case Code (Imperial): 0402; Min Operating Temperature: -55 degC; Radiation Hardening: No; Length: 1 mm; Package Quantity: 10000; PackageDescription: 2-Pin Surface Mount Device, Body 1 x 0.5 mm; Mounting Technology: Surface Mount; Case Code (Metric): 1005; Packaging: Tape and Reel; ComponentLink1URL: http://www.panasonic.com/; RoHSCompliant: true; Max Operating Temperature: 155 degC; REACH SVHC: Yes; ComponentLink1Description: Manufacturer URL; ComponentLink2URL: http://industrial.panasonic.com/cdbs/www-data/pdf/RDA0000/AOA0000C86.pdf; Mount: Surface Mount
R?#3-R?#8 = CMP-2002-01154-4: Chip Resistor, 4.7 KOhm, +/- 1%, 0.1 W, -55 to 155 degC, 0402 (1005 Metric), RoHS, Tape and Reel; PartNumber: ERJ-2RKF4701X; Voltage Rating: 50 V; Case\/Package: 0402; Power Rating: 100 mW; Height: 0.35 mm; Mounting Technology: Surface Mount; REACH SVHC: Yes; Resistance: 4.7 KOhm; Max Operating Temperature: 155 degC; ComponentLink1Description: Manufacturer URL; ComponentLink2Description: Datasheet; Pins: 2; PackageReference: 0402; Tolerance: 1%; Case Code (Imperial): 0402; Length: 1 mm; PackageDescription: 2-Pin Surface Mount Device, Body 1 x 0.5 mm; RoHSCompliant: true; Package Quantity: 1; Radiation Hardening: No; DatasheetVersion: 04/2015; Width: 0.5 mm; Case Code (Metric): 1005; Mount: Surface Mount; ComponentLink1URL: http://www.panasonic.com/; Min Operating Temperature: -55 degC; Packaging: Cut Tape; ComponentLink2URL: http://industrial.panasonic.com/cdbs/www-data/pdf/RDA0000/AOA0000C86.pdf
U1 = CMP-0383-00028-1: as U1 on sheet BoardB-FPGA; ComponentLink2Description: Datasheet; ComponentLink2URL: http://www.xilinx.com/support/documentation/data_sheets/ds180_7Series_Overview.pdf; ComponentLink1Description: Manufacturer URL; Operating Temperature Range: Commercial; PackageVersion: Rev. 1.11; ComponentLink4URL: http://www.xilinx.com/support/documentation/user_guides/ug475_7Series_Pkg_Pinout.pdf; ComponentLink4Description: Package Specification; PackageDescription: 256-Ball Wire-Bond Fine-Pitch Thin BGA, Body 17 x 17 mm, Pitch 1 mm; Mounting Technology: Surface Mount; ComponentLink1URL: http://www.xilinx.com/; Maximum Distributed RAM: 400 Kb; PackageReference: FTG-256; DatasheetVersion: Rev. 1.15; ComponentLink3Description: Pinout; PartNumber: XC7A35T-1FTG256C; ComponentLink3URL: http://www.xilinx.com/support/documentation/user_guides/ug475_7Series_Pkg_Pinout.pdf

## Sheet BoardB-FPGA3.SchDoc
size A; SheetNumber: 5; SheetTotal: 9
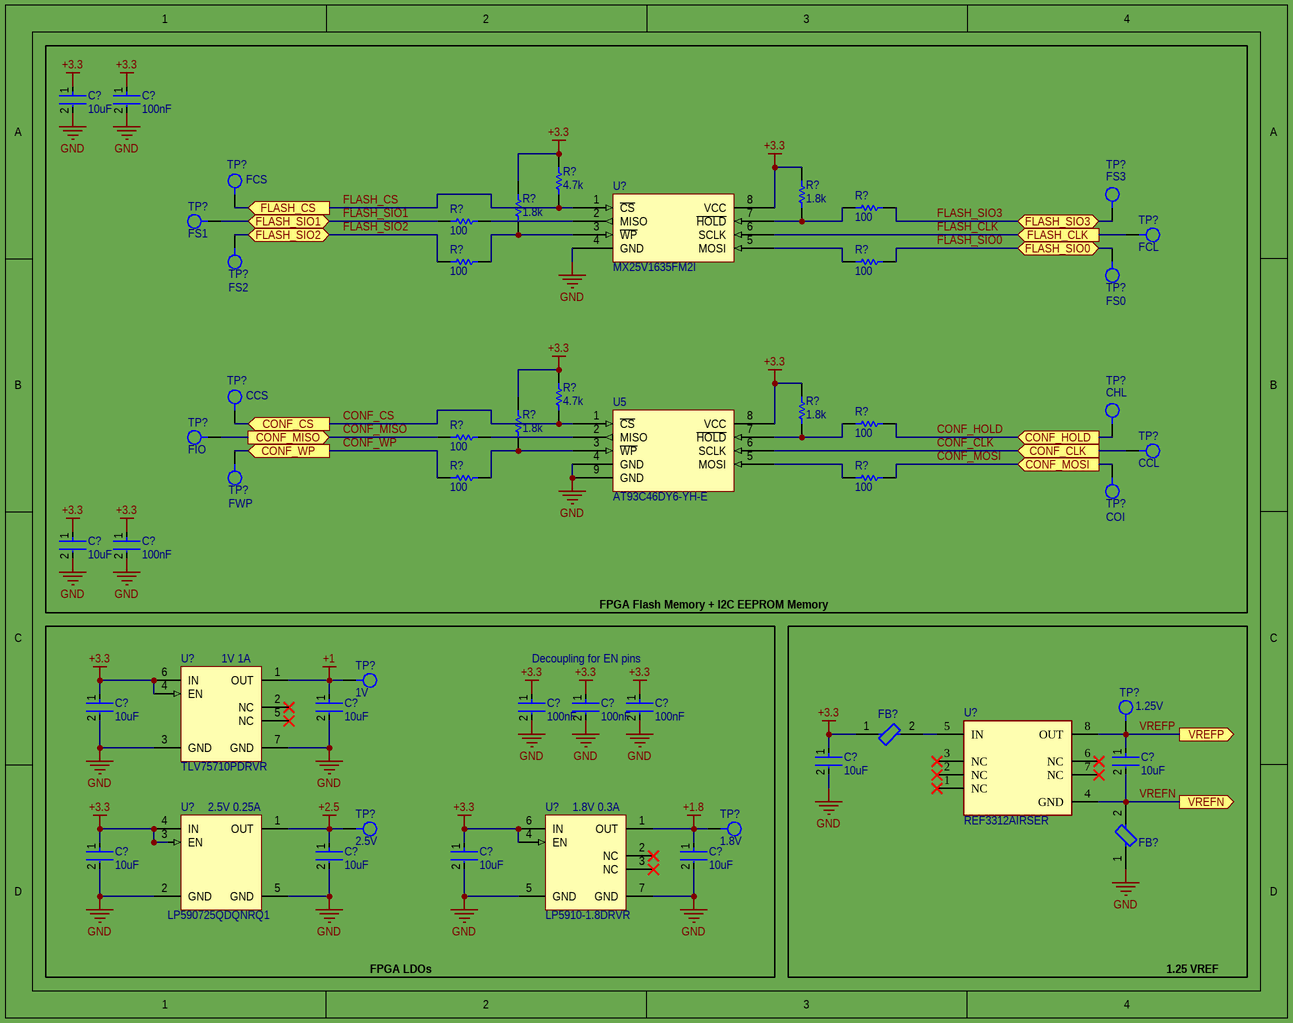
[diagram p4: BoardB-FPGA3.SchDoc]

### Parts
(Parts that share a designator on the sheet are numbered #1, #2 ... from top to bottom, then left to right.)
C?#47  10uF  [FP-GRM188-0_1-e0_2_0_55-IPC_A]
C?#48  100nF  [FP-CGA3E-0_3-0_1-IPC_A]
C?#49  10uF  [FP-GRM188-0_1-e0_2_0_55-IPC_A]
C?#50  100nF  [FP-CGA3E-0_3-0_1-IPC_A]
C?#51  10uF  [FP-GRM188-0_1-e0_2_0_55-IPC_A]
C?#52  10uF  [FP-GRM188-0_1-e0_2_0_55-IPC_A]
C?#53  100nF  [FP-CGA3E-0_3-0_1-IPC_A]
C?#54  100nF  [FP-CGA3E-0_3-0_1-IPC_A]
C?#55  100nF  [FP-CGA3E-0_3-0_1-IPC_A]
C?#56  10uF  [FP-GRM188-0_1-e0_2_0_55-IPC_A]
C?#57  10uF  [FP-GRM188-0_1-e0_2_0_55-IPC_A]
C?#58  10uF  [FP-GRM188-0_1-e0_2_0_55-IPC_A]
C?#59  10uF  [FP-GRM188-0_1-e0_2_0_55-IPC_A]
C?#60  10uF  [FP-GRM188-0_1-e0_2_0_55-IPC_A]
C?#61  10uF  [FP-GRM188-0_1-e0_2_0_55-IPC_A]
FB?#3  BLM18AG601SN1D  [FP-BLM18-0_15-t0_8-MFG]  (value not drawn)
FB?#4  BLM18AG601SN1D  [FP-BLM18-0_15-t0_8-MFG]  (value not drawn)
R?#9  4.7k  [RESC1005X40X25ML05T05]
R?#10  100  [RESC0603X26X15ML03T05]
R?#11  100  [RESC0603X26X15ML03T05]
R?#12  1.8k  [RESC1005X40X25LL05T05]
R?#13  1.8k  [RESC1005X40X25LL05T05]
R?#14  100  [RESC0603X26X15ML03T05]
R?#15  100  [RESC0603X26X15ML03T05]
R?#16  4.7k  [RESC1005X40X25ML05T05]
R?#17  100  [RESC0603X26X15ML03T05]
R?#18  100  [RESC0603X26X15ML03T05]
R?#19  1.8k  [RESC1005X40X25LL05T05]
R?#20  1.8k  [RESC1005X40X25LL05T05]
R?#21  100  [RESC0603X26X15ML03T05]
R?#22  100  [RESC0603X26X15ML03T05]
TP?#1  FCS
TP?#2  FS1
TP?#3  FS3
TP?#4  FS2
TP?#5  FCL
TP?#6  FS0
TP?#7  CCS
TP?#8  FIO
TP?#9  CHL
TP?#10  FWP
TP?#11  CCL
TP?#12  COI
TP?#13  1V
TP?#14  1.25V
TP?#15  2.5V
TP?#16  1.8V
U5#1  AT93C46DY6-YH-E  [AT93C46DY6-YH-E]
U?#1  MX25V1635FM2I
U?#2  TLV75710PDRVR
U?#3  REF3312AIRSER  [FP-RSE0008A-MFG]
U?#4  LP590725QDQNRQ1  [LP5907]
U?#5  LP5910-1.8DRVR  [LP5910]

### Blocks framed on the sheet
FPGA Flash Memory + I2C EEPROM Memory: C?#47-C?#50 R?#9-R?#22 TP?#1-TP?#12 U5#1 U?#1
1.25 VREF: C?#56 C?#57 FB?#3 FB?#4 TP?#14 U?#3

### Ports
CONF_CLK (in), CONF_CS (in), CONF_HOLD (in), CONF_MISO (out), CONF_MOSI (in), CONF_WP (in), FLASH_CLK (in), FLASH_CS (in), FLASH_SIO0 (bidir), FLASH_SIO1 (bidir), FLASH_SIO2 (bidir), FLASH_SIO3 (bidir), VREFN (out), VREFP (out)

### Nets
+1: C?#52.1 TP?#13.1 U?#2.1(OUT)
+1.8: C?#61.1 TP?#16.1 U?#5.1(OUT)
+2.5: C?#59.1 TP?#15.1 U?#4.1(OUT)
+3.3: C?#47.1 C?#48.1 C?#49.1 C?#50.1 C?#51.1 C?#53.1 C?#54.1 C?#55.1 C?#56.1 C?#58.1 C?#60.1 FB?#3.1 R?#9.2 R?#12.2 R?#13.2 R?#16.2 R?#19.2 R?#20.2 U5#1.8(VCC) U?#1.8(VCC) U?#2.4(EN) U?#2.6(IN) U?#4.3(EN) U?#4.4(IN) U?#5.4(EN) U?#5.6(IN)
GND: C?#47.2 C?#48.2 C?#49.2 C?#50.2 C?#51.2 C?#52.2 C?#53.2 C?#54.2 C?#55.2 C?#56.2 C?#58.2 C?#59.2 C?#60.2 C?#61.2 FB?#4.1 U5#1.4(GND) U5#1.9(GND) U?#1.4(GND) U?#2.3(GND) U?#2.7(GND) U?#4.2(GND) U?#4.5(GND) U?#5.5(GND) U?#5.7(GND)
CONF_CLK: TP?#11.1 U5#1.6(SCLK) ; port CONF_CLK
CONF_CS: R?#16.1 TP?#7.1 U5#1.1(~{CS}) ; port CONF_CS
CONF_HOLD: R?#17.2 TP?#9.1 ; port CONF_HOLD
CONF_MISO: R?#18.1 TP?#8.1 ; port CONF_MISO
CONF_MOSI: R?#22.2 TP?#12.1 ; port CONF_MOSI
CONF_WP: R?#21.1 TP?#10.1 ; port CONF_WP
FLASH_CLK: TP?#5.1 U?#1.6(SCLK) ; port FLASH_CLK
FLASH_CS: R?#9.1 TP?#1.1 U?#1.1(~{CS}) ; port FLASH_CS
FLASH_SIO0: R?#15.2 TP?#6.1 ; port FLASH_SIO0
FLASH_SIO1: R?#11.1 TP?#2.1 ; port FLASH_SIO1
FLASH_SIO2: R?#14.1 TP?#4.1 ; port FLASH_SIO2
FLASH_SIO3: R?#10.2 TP?#3.1 ; port FLASH_SIO3
VREFN: C?#57.2 FB?#4.2 U?#3.4(GND) ; port VREFN
VREFP: C?#57.1 TP?#14.1 U?#3.8(OUT) ; port VREFP
NetFB?#3_2: FB?#3.2 U?#3.5(IN)
NetR?#10_1: R?#10.1 R?#12.1 U?#1.7(~{HOLD})
NetR?#11_2: R?#11.2 U?#1.2(MISO)
NetR?#13_1: R?#13.1 R?#14.2 U?#1.3(~{WP})
NetR?#15_1: R?#15.1 U?#1.5(MOSI)
NetR?#17_1: R?#17.1 R?#19.1 U5#1.7(~{HOLD})
NetR?#18_2: R?#18.2 U5#1.2(MISO)
NetR?#20_1: R?#20.1 R?#21.2 U5#1.3(~{WP})
NetR?#22_1: R?#22.1 U5#1.5(MOSI)

Not connected (* = marked no-connect by the designer): U?#2 2(NC)* 5(NC)*; U?#3 1(NC)* 2(NC)* 3(NC)* 6(NC)* 7(NC)*; U?#5 2(NC)* 3(NC)*

### Notes on the sheet
- (near U?#2) 1V 1A
- (near C?#55) Decoupling for EN pins
- (near U?#4) 2.5V 0.25A
- (near U?#5) 1.8V 0.3A
- FPGA LDOs

### Library data of the parts
C?#47 C?#49 C?#51 C?#52 C?#56-C?#61 = CMP-2006-02792-2: as C16 on sheet BoardB-FPGA; Packaging: Tape and Reel; Voltage Rating (DC): 6.3V; Width: 0.031inch; Termination: SMD/SMT; Dielectric: X5R; Package Quantity: 4000; Voltage Rating: 6.3V; Capacitance: 10uF; Case/Package: 0603; Min Operating Temperature: -55°C; Voltage: 6.3V; Length: 1.6mm; Thickness: 0.035inch; Lead Free: Lead Free; Depth: 0.8mm; Case Code (Imperial): 0603; Max Operating Temperature: 85°C; Material: Ceramic; Height: 0.8mm; Tolerance: 20%; Mount: Surface Mount; REACH SVHC: No SVHC; Radiation Hardening: No; Case Code (Metric): 1608
C?#48 C?#50 C?#53-C?#55 = CMP-2000-07546-2: as C17 on sheet BoardB-FPGA; Weight: 7.1E-05oz; Composition: Ceramic; Max Operating Temperature: 125°C; Termination: SMD/SMT; Dielectric: X7R; Length: 1.6mm; Package Quantity: 1; REACH SVHC: No SVHC; Lead Free: Lead Free; Case Code (Metric): 1608; Min Operating Temperature: -55°C; Packaging: Tape and Reel; Tolerance: 10%; Voltage Rating: 50V; Case Code (Imperial): 0603; Capacitance: 100nF; Case/Package: 0603; Voltage Rating (DC): 50V; Depth: 0.8mm; Radiation Hardening: No; Ratings: AEC-Q200; Mount: Surface Mount; Voltage: 50V; Thickness: 0.035inch; Width: 0.8mm; Height: 0.8mm
FB?#3 FB?#4 = CMP-0686-00436-3: as FB?#1 on sheet BoardB-FPGA2; Max DC Current: 500mA; Termination: SMD/SMT; Military Standard: Not; Number of Circuits: 1; Min Operating Temperature: -55°C; Case Code (Imperial): 0603; Width: 0.8mm; Current Rating: 500mA; Lead Free: Lead Free; Packaging: Tape and Reel; Frequency: 100MHz; Max Operating Temperature: 125°C; DC Current: 500mA; REACH SVHC: No SVHC; Case/Package: 0603; Package Quantity: 1; Height: 0.8mm; Number of Pins: 2; Depth: 0.8mm; Test Frequency: 100MHz; Case Code (Metric): 1608; Tolerance: 25%; Core Material: Ferrite; Weight: 7.1E-05oz; Max Current Rating: 500mA; Radiation Hardening: No; Length: 1.6mm; RoHS Compliant: Yes
R?#9 R?#16 = CMP-2002-01154-4: as R?#3 on sheet BoardB-FPGA2; Height: 0.35 mm; Mounting Technology: Surface Mount; REACH SVHC: Yes; Resistance: 4.7 KOhm; Max Operating Temperature: 155 degC; ComponentLink1Description: Manufacturer URL; ComponentLink2Description: Datasheet; Pins: 2; PackageReference: 0402; Tolerance: 1%; Case Code (Imperial): 0402; Length: 1 mm; PackageDescription: 2-Pin Surface Mount Device, Body 1 x 0.5 mm; RoHSCompliant: true; Package Quantity: 1; Radiation Hardening: No; DatasheetVersion: 04/2015; Width: 0.5 mm; Case Code (Metric): 1005; Mount: Surface Mount; ComponentLink1URL: http://www.panasonic.com/; Min Operating Temperature: -55 degC; Packaging: Cut Tape; ComponentLink2URL: http://industrial.panasonic.com/cdbs/www-data/pdf/RDA0000/AOA0000C86.pdf
R?#10 R?#11 R?#14 R?#15 R?#17 R?#18 R?#21 R?#22 = CMP-2004-03565-1: Manufacturer: TE Connectivity / AMP; Part Number: CRG0201F100R
R?#12 R?#13 R?#19 R?#20 = CMP-2002-01128-1: Manufacturer: Panasonic; Part Number: ERJ2RKF1801X
TP?#1-TP?#16 = TestPoint1mm
U5#1 = AT93C46DY6-YH-E: EEPROM Memory IC 1Kb (128 x 8, 64 x 16) SPI 8-UDFN (2x3); Manufacturer: Microchip; Manufacturer Part Number: AT25040B-MAHL-E; RoHS: Yes; Supplier 1: Digi-Key; Supplier Part Number 1: AT93C46DY6-YH-ECT-ND
U?#1 = MX25V1635FM2I: IC FLASH 16M SPI 80MHZ 8SOP; Manufacturer: Macronix; Memory Type: FLASH,NOR; Interface: SPI,Serial; Supplier 1: Digi-Key; Manufacturer Part Number: MX25V1635FM2I; RoHS: Yes; Category: Memory; Stock 1: 14366; Pricing 1: 1=0.71000, 10=0.64700, 25=0.63880, 50=0.63480, 100=0.56770, 250=0.56288, 500=0.55456, 1000=0.53472, 5000=0.48704 (USD); Case/Package: SOIC; Min Operating Temperature: -40°C; Max Operating Temperature: 85°C; Packaging: Rail/Tube; Frequency: 80MHz; Lead Free: Lead Free; RoHS Compliant: Yes; ComponentLink1URL: http://ckassoc.com/oldsite/pdf/Macronix_Product_Line_Card_July_2017_General%20_070617.pdf?src-supplier=Digi-Key; ComponentLink1Description: http://ckassoc.com/oldsite/pdf/Macronix_Product_Line_Card_July_2017_General%20_070617.pdf?src-supplier=Digi-Key; Supplier Part Number 1: 1092-1189-ND
U?#2 = TLV75710PDRVR: 1-A low-IQ small-size low-dropout (LDO) regulator 6-WSON -40 to 125; Manufacturer Part Number: LP5910-1.0DRVR; Manufacturer: Texas Instruments; Output Voltage: 1V; Output Current: 300mA; Number of Regulators: 1; Quiescent Current: 12uA; Dropout Voltage: 120mV; Output Type: Fixed; Output Configuration: Positive; Max Input Voltage: 5.5V; Max Supply Current: 40uA; Power Supply Rejection Ratio (PSRR): 52dB; RoHS: Yes; Stock 1: 2189; Pricing 1: 1=0.63000, 10=0.53700, 50=0.53700, 100=0.37200, 1000=0.24400, 10000=0.19500 (USD); Mount: Surface Mount; Min Operating Temperature: -40°C; Max Operating Temperature: 125°C; Packaging: Tape and Reel; Lead Free: Lead Free; RoHS Compliant: Yes; ComponentLink1URL: http://www.ti.com/lit/ds/symlink/lp5910.pdf?src-supplier=Digi-Key; ComponentLink1Description: http://www.ti.com/lit/ds/symlink/lp5910.pdf?src-supplier=Digi-Key; ComponentLink2URL: http://www.ti.com/general/docs/suppproductinfo.tsp?distId=10&amp;gotoUrl=http%3A%2F%2Fwww.ti.com%2Flit%2Fgpn%2Flp5910&src-supplier=Digi-Key; ComponentLink2Description: http://www.ti.com/general/docs/suppproductinfo.tsp?distId=10&amp;gotoUrl=http%3A%2F%2Fwww.ti.com%2Flit%2Fgpn%2Flp5910&src-supplier=Digi-Key; Category: Voltage Regulators - Linear; Stock 2: 1477; Pricing 2: 1=0.61000, 10=0.53900, 25=0.50600, 100=0.41300, 250=0.38360, 500=0.32648, 1000=0.26950 (USD); Min Output Voltage: 1V; ComponentLink3URL: http://www.ti.com/lit/ds/symlink/tlv757p.pdf?src-supplier=Digi-Key; ComponentLink3Description: http://www.ti.com/lit/ds/symlink/tlv757p.pdf?src-supplier=Digi-Key; Supplier 1: Digi-Key; Supplier Part Number 1: 296-50004-1-ND
U?#3 = CMP-04916-000026-1: IC VREF SERIES 0.15% 8UQFN; Output Current: 5mA; Operating Supply Current: 8.5uA; Temperature Coefficient: 30ppm/°C; Output Type: Fixed; Min Output Voltage: 1.25V; Tolerance: 0.15%; Min Operating Temperature: -40°C; Max Operating Temperature: 125°C; RoHS Compliant: Yes; Reference Type: Series; Number of Pins: 8; Mount: Surface Mount; Packaging: Tape and Reel
U?#4 = LP590725QDQNRQ1: LDO Regulator Pos 1.2V to 4.5V 0.25A 4-Pin X2SON EP T/R; Manufacturer: Texas Instruments; Supplier 1: Digi-Key; RoHS: Yes; Stock 1: 2810; Pricing 1: 1=0.64000, 10=0.56000, 25=0.52560, 100=0.42910, 250=0.39856, 500=0.33920, 1000=0.28000 (USD); Manufacturer Part Number: LP590725QDQNRQ1; Supplier Part Number 1: 296-LP590725QDQNRQ1CT-ND; Category: Integrated Circuits (ICs)
U?#5 = LP5910-1.8DRVR: IC REG LINEAR 1.8V 300MA 6SON; Manufacturer: Texas Instruments; Dropout Voltage: 145mV; Number of Regulators: 1; Quiescent Current: 12uA; Supplier 1: Digi-Key; RoHS: Yes; Stock 1: 556; Pricing 1: 1=0.63000, 10=0.53700, 25=0.50080, 100=0.40070, 250=0.37208, 500=0.31482, 1000=0.24327 (USD); Mount: Surface Mount; Min Operating Temperature: -40°C; Max Operating Temperature: 125°C; Packaging: Tape and Reel; Output Voltage: 1.8V; Output Current: 300mA; Lead Free: Lead Free; RoHS Compliant: Yes; ComponentLink1URL: http://www.ti.com/general/docs/suppproductinfo.tsp?distId=10&amp;gotoUrl=http%3A%2F%2Fwww.ti.com%2Flit%2Fgpn%2Flp5910&src-supplier=Digi-Key; ComponentLink1Description: http://www.ti.com/general/docs/suppproductinfo.tsp?distId=10&amp;gotoUrl=http%3A%2F%2Fwww.ti.com%2Flit%2Fgpn%2Flp5910&src-supplier=Digi-Key; ComponentLink2URL: http://www.ti.com/lit/ds/symlink/lp5910.pdf?src-supplier=Digi-Key; ComponentLink2Description: http://www.ti.com/lit/ds/symlink/lp5910.pdf?src-supplier=Digi-Key; Manufacturer Part Number: LP5910-1.8DRVR; Supplier Part Number 1: 296-47212-1-ND; Category: Voltage Regulators - Linear